# Altium schematic sheet Switch.SchDoc
size A4
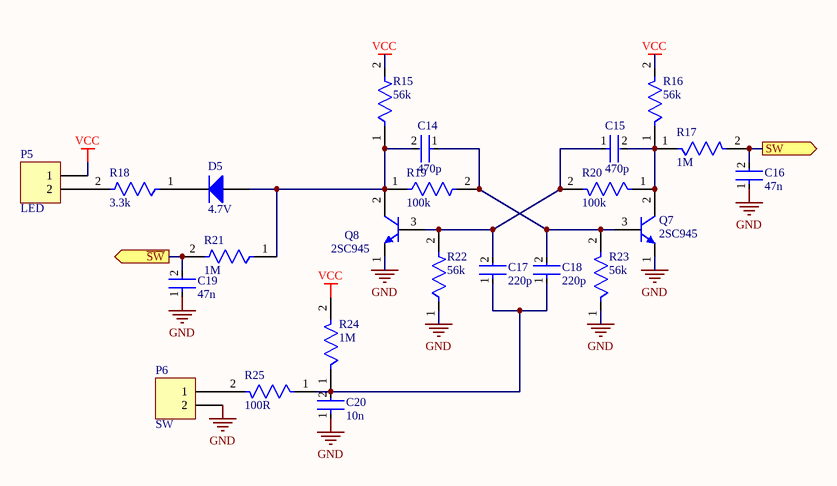
[diagram p0: Switch.SchDoc]

## Parts
C14  470p  [FP-CL10-IPC_A]
C15  470p  [FP-CL10-IPC_A]
C16  47n  [FP-CL10-IPC_A]
C17  220p  [FP-CL10-IPC_A]
C18  220p  [FP-CL10-IPC_A]
C19  47n  [FP-CL10-IPC_A]
C20  10n  [FP-CL10-IPC_A]
D5  4.7V  [DO-41]
P5  LED  [HDR1X2]
P6  SW  [HDR1X2]
Q7  2SC945  [TO-92]
Q8  2SC945  [TO-92]
R15  56k  [FP-RT0805-MFG]
R16  56k  [FP-RT0805-MFG]
R17  1M  [FP-RT0805-MFG]
R18  3.3k  [FP-RT0805-MFG]
R19  100k  [FP-RT0805-MFG]
R20  100k  [FP-RT0805-MFG]
R21  1M  [FP-RT0805-MFG]
R22  56k  [FP-RT0805-MFG]
R23  56k  [FP-RT0805-MFG]
R24  1M  [FP-RT0805-MFG]
R25  100R  [FP-RT0805-MFG]

## Ports
SW (out), ~{SW} (out)

## Nets
GND: C16.1 C19.1 C20.1 P6.2 Q7.1(E) Q8.1(E) R22.1 R23.1
VCC: P5.1 R15.2 R16.2 R24.2
~{SW}: C19.2 R21.2 ; port ~{SW}
SW: C16.2 R17.2 ; port SW
NetC14_1: C14.1 C18.2 Q7.3(B) R19.2 R23.2
NetC14_2: C14.2 D5.1(A) Q8.2(C) R15.1 R19.1 R21.1
NetC15_1: C15.1 C17.2 Q8.3(B) R20.2 R22.2
NetC15_2: C15.2 Q7.2(C) R16.1 R17.1 R20.1
NetC17_1: C17.1 C18.1 C20.2 R24.1 R25.1
NetD5_2: D5.2(K) R18.1
NetP5_2: P5.2 R18.2
NetP6_1: P6.1 R25.2

## Library data of the parts
C14-C20 = CMP-13271-004807-1: Cap Ceramic 1nF 50V C0G ±5% Pad SMD 0603 +125°C T/R; Temperature Coefficient: 300ppm/°C; Voltage Rating (DC): 50V; Length: 1.6mm; Width: 0.031inch; Series: CL; Case Code (Imperial): 0603; Voltage: 50V; Lead Free: Lead Free; Packaging: Tape and Reel; Dielectric: C0G; Material: Ceramic; Thickness: 0.035inch; Max Operating Temperature: 125°C; Package Quantity: 1; RoHS Compliant: Yes; Radiation Hardening: No; Capacitance: 1nF; Mount: Surface Mount; Voltage Rating: 50V; Height: 0.8mm; Tolerance: 5%; Min Operating Temperature: -55°C; Case Code (Metric): 1608; Case/Package: 0603; Depth: 0.8mm
D5 = DIODE_SW
P5 P6 = Header 2: Header, 2-Pin; LatestRevisionDate: 17-Jul-2002; LatestRevisionNote: Re-released for DXP Platform.; Publisher: Altium Limited
Q7 Q8 = BJT_NPN
R15-R25 = CMP-2001-01759-2: RES SMD 10K OHM 0.1% 1/8W 0805; Manufacturer Part Number: RT0805BRE0710KL; Manufacturer: Yageo; Voltage Rating: 150V; Resistance: 10KΩ; Tolerance: 0.0025; Temperature Coefficient: 50 ppm/°C; Power Rating: 0.125W; Value: 10KΩ; Temperature Range Low: -55°C; Device Class L2: Resistors; RoHS: TRUE; Series: RT; Device Class L1: Passive Components; Ipc Land Pattern Name: RESC200125X50; Category: Res; Automotive: No; ComponentLink2Description: Datasheet; ComponentLink2URL: http://www.yageo.com/documents/recent/PYu-RT_1-to-0.01_RoHS_L_9.pdf; Digikey Description: RES SMD 10K OHM 0.1% 1/8W 0805; Package: RT0805; Device Class L3: Chip SMD Resistors; Octopart: https://octopart.com/rt0805bre0710kl-yageo-1239246; Temperature Range High: +155°C; Lead Free: Yes; Height: 0.6mm; Composition: Thin Film; Footprint Url: http://www.yageo.com/exep/pages/download/literatures/PYu-R_Mount_10.pdf; Temperature: -55°C to +155°C; Mouser Description: Thin Film Resistors 10K ohm 0.1% 1/8W